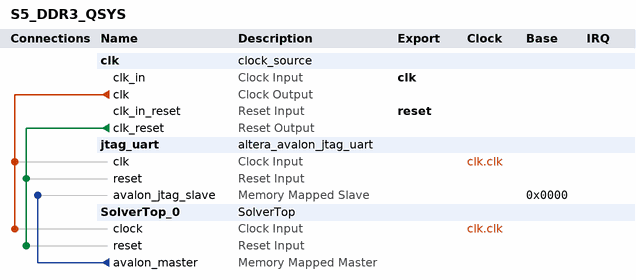
[diagram p0: system contents]
# Platform Designer (Qsys) system S5_DDR3_QSYS, Stratix V 5SGXEA7N2F45C2
# Parameters at their usual value, and those the tool derives, are not listed.
package require -exact qsys 16.0
create_system S5_DDR3_QSYS
set_project_property DEVICE_FAMILY {Stratix V}
set_project_property DEVICE 5SGXEA7N2F45C2

add_instance clk clock_source 16.0
set_instance_parameter_value clk clockFrequency 100000000

add_instance jtag_uart altera_avalon_jtag_uart 16.0
set_instance_parameter_value jtag_uart simInteractiveOptions NO_INTERACTIVE_WINDOWS

add_instance SolverTop_0 SolverTop 1.0

# connections
add_connection clk.clk jtag_uart.clk clock
add_connection clk.clk SolverTop_0.clock clock
add_connection clk.clk_reset jtag_uart.reset reset
add_connection clk.clk_reset SolverTop_0.reset reset
add_connection SolverTop_0.avalon_master jtag_uart.avalon_jtag_slave avalon
set_connection_parameter_value SolverTop_0.avalon_master/jtag_uart.avalon_jtag_slave baseAddress 0x0000

# exported interfaces
add_interface clk clock sink
set_interface_property clk EXPORT_OF clk.clk_in
add_interface reset reset sink
set_interface_property reset EXPORT_OF clk.clk_in_reset

set_interconnect_requirement {$system} qsys_mm.clockCrossingAdapter FIFO
set_interconnect_requirement {$system} qsys_mm.maxAdditionalLatency 4

save_system S5_DDR3_QSYS.qsys
